# Altium schematic sheet Driver.SchDoc
size A3
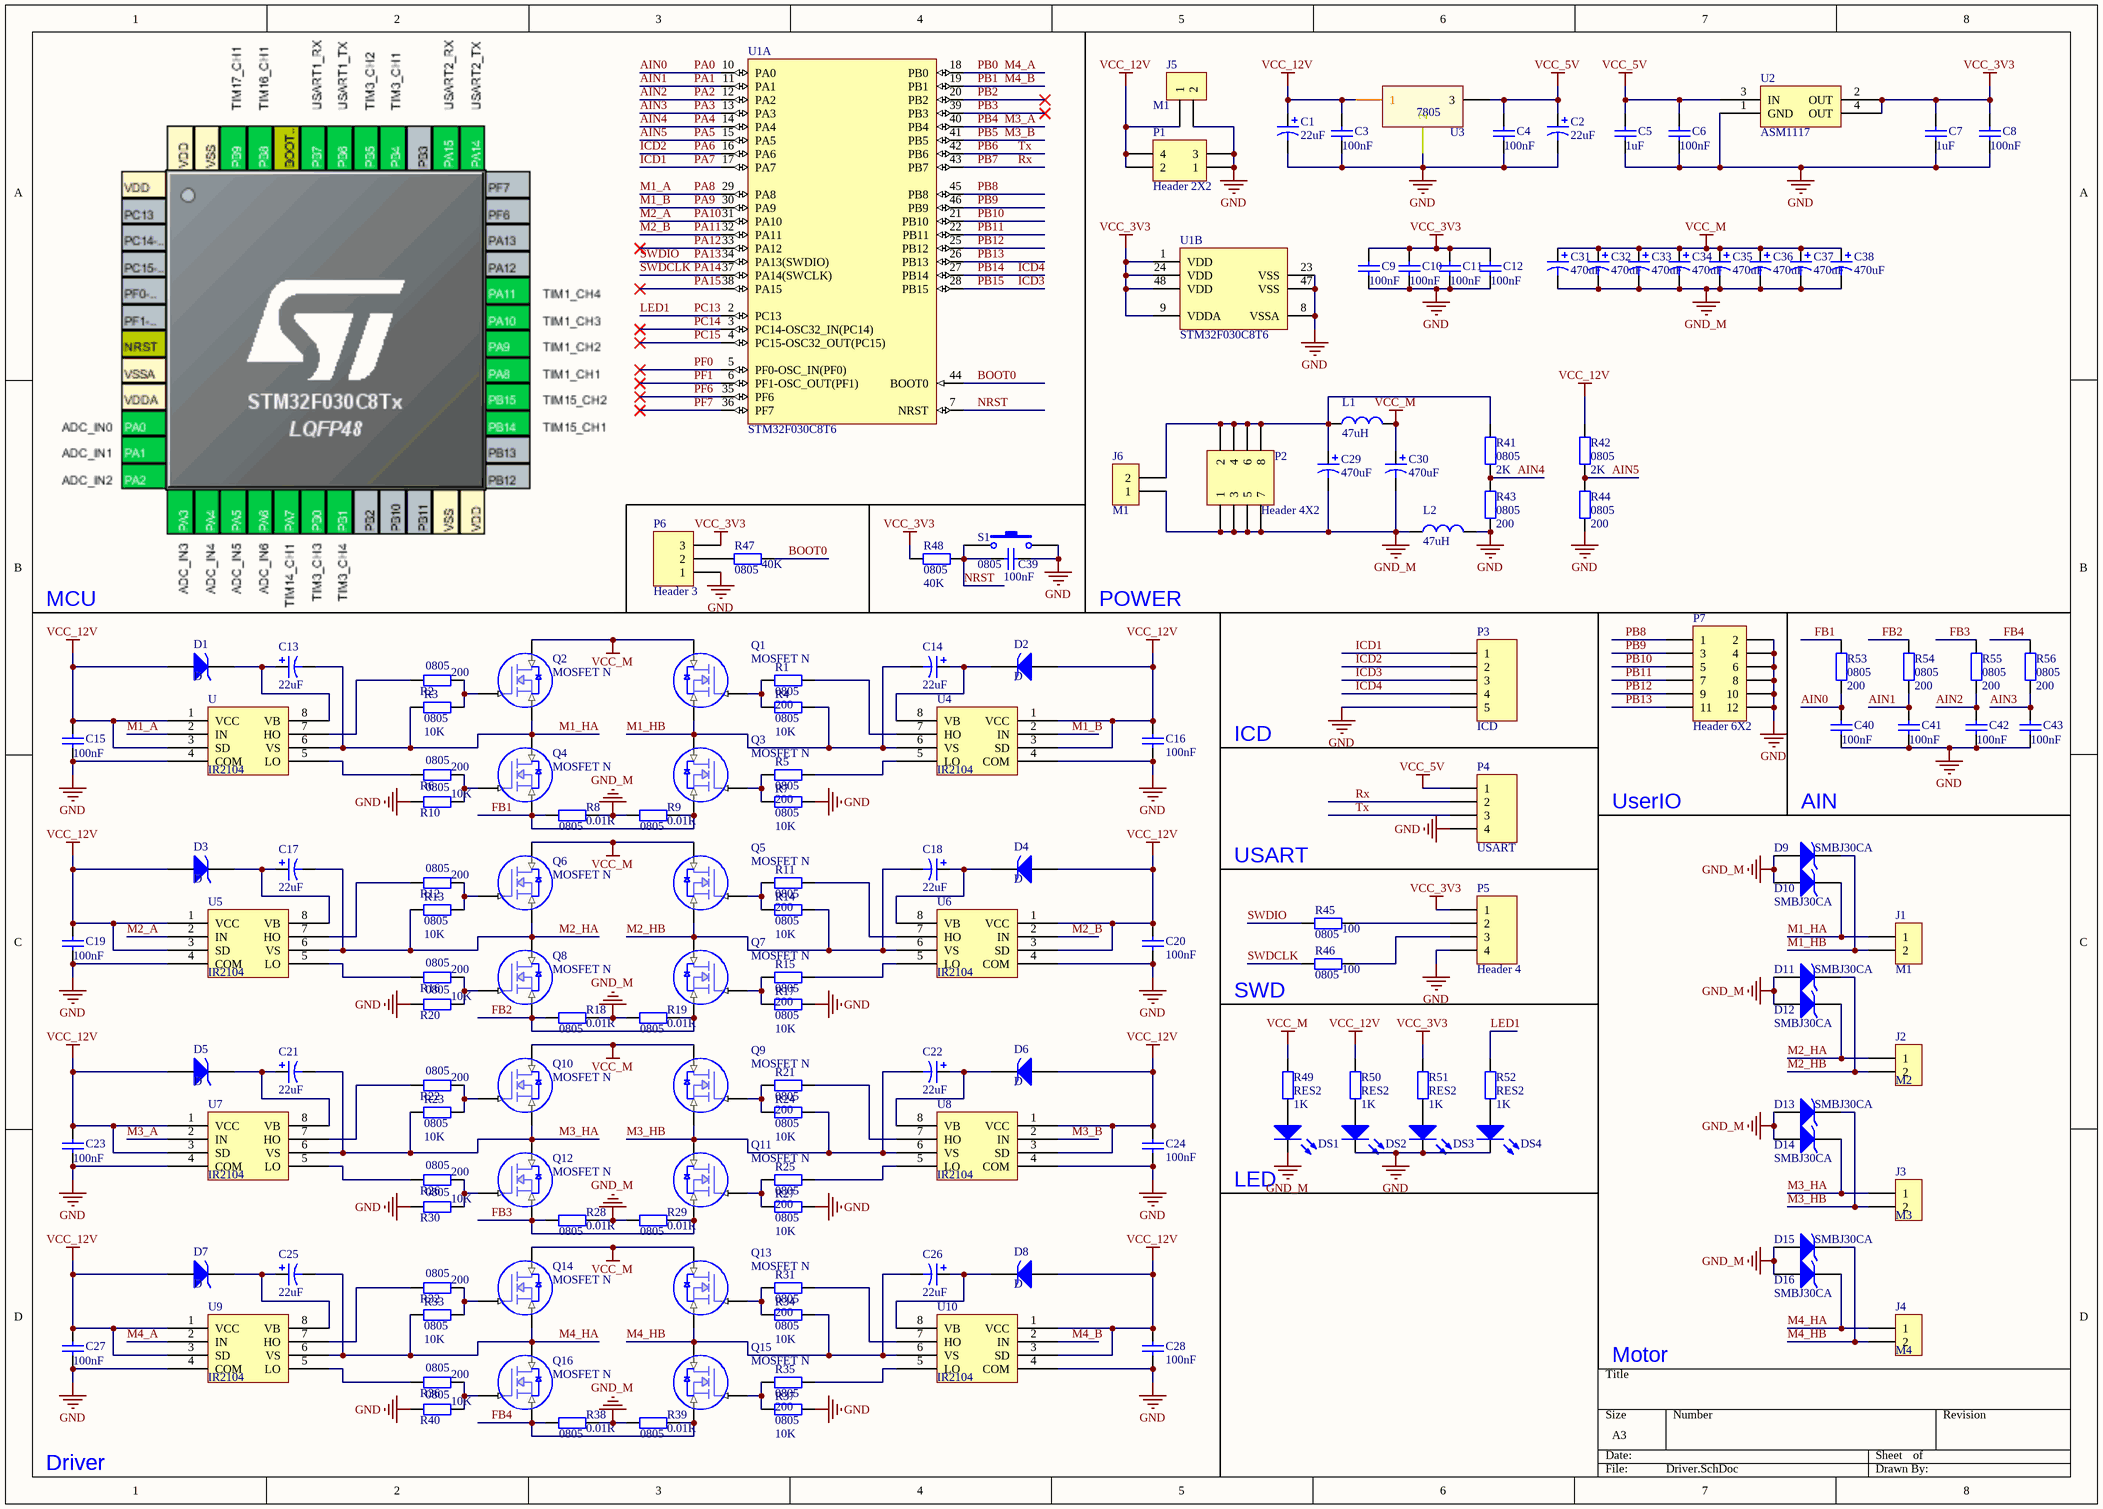
[diagram p0: Driver.SchDoc]

## Parts
C1  value 22uF  [CD C(6032)]  (hidden comment: CAP-ELEC)
C2  value 22uF  [CD C(6032)]  (hidden comment: CAP-ELEC)
C3  value 100nF  [C 0805_L]  (hidden comment: CAP)
C4  value 100nF  [C 0805_L]  (hidden comment: CAP)
C5  value 1uF  [C 0805_L]  (hidden comment: CAP)
C6  value 100nF  [C 0805_L]  (hidden comment: CAP)
C7  value 1uF  [C 0805_L]  (hidden comment: CAP)
C8  value 100nF  [C 0805_L]  (hidden comment: CAP)
C9  value 100nF  [C 0805_L]  (hidden comment: CAP)
C10  value 100nF  [C 0805_L]  (hidden comment: CAP)
C11  value 100nF  [C 0805_L]  (hidden comment: CAP)
C12  value 100nF  [C 0805_L]  (hidden comment: CAP)
C13  value 22uF  [CD C(6032)]  (hidden comment: CAP-ELEC)
C14  value 22uF  [CD C(6032)]  (hidden comment: CAP-ELEC)
C15  value 100nF  [C 0805_L]  (hidden comment: CAP)
C16  value 100nF  [C 0805_L]  (hidden comment: CAP)
C17  value 22uF  [CD C(6032)]  (hidden comment: CAP-ELEC)
C18  value 22uF  [CD C(6032)]  (hidden comment: CAP-ELEC)
C19  value 100nF  [C 0805_L]  (hidden comment: CAP)
C20  value 100nF  [C 0805_L]  (hidden comment: CAP)
C21  value 22uF  [CD C(6032)]  (hidden comment: CAP-ELEC)
C22  value 22uF  [CD C(6032)]  (hidden comment: CAP-ELEC)
C23  value 100nF  [C 0805_L]  (hidden comment: CAP)
C24  value 100nF  [C 0805_L]  (hidden comment: CAP)
C25  value 22uF  [CD C(6032)]  (hidden comment: CAP-ELEC)
C26  value 22uF  [CD C(6032)]  (hidden comment: CAP-ELEC)
C27  value 100nF  [C 0805_L]  (hidden comment: CAP)
C28  value 100nF  [C 0805_L]  (hidden comment: CAP)
C29  value 470uF  [CM E(8*10.2)]  (hidden comment: CAP-ELEC)
C30  value 470uF  [CM E(8*10.2)]  (hidden comment: CAP-ELEC)
C31  value 470uF  [CM E(8*10.2)]  (hidden comment: CAP-ELEC)
C32  value 470uF  [CM E(8*10.2)]  (hidden comment: CAP-ELEC)
C33  value 470uF  [CM E(8*10.2)]  (hidden comment: CAP-ELEC)
C34  value 470uF  [CM E(8*10.2)]  (hidden comment: CAP-ELEC)
C35  value 470uF  [CM E(8*10.2)]  (hidden comment: CAP-ELEC)
C36  value 470uF  [CM E(8*10.2)]  (hidden comment: CAP-ELEC)
C37  value 470uF  [CM E(8*10.2)]  (hidden comment: CAP-ELEC)
C38  value 470uF  [CM E(8*10.2)]  (hidden comment: CAP-ELEC)
C39  0805  value 100nF  [C 0805_M]
C40  value 100nF  [C 0805_L]  (hidden comment: CAP)
C41  value 100nF  [C 0805_L]  (hidden comment: CAP)
C42  value 100nF  [C 0805_L]  (hidden comment: CAP)
C43  value 100nF  [C 0805_L]  (hidden comment: CAP)
D1  D  [SOD-123]
D2  D  [SOD-123]
D3  D  [SOD-123]
D4  D  [SOD-123]
D5  D  [SOD-123]
D6  D  [SOD-123]
D7  D  [SOD-123]
D8  D  [SOD-123]
D9  SMBJ30CA  [SMB]
D10  SMBJ30CA  [SMB]
D11  SMBJ30CA  [SMB]
D12  SMBJ30CA  [SMB]
D13  SMBJ30CA  [SMB]
D14  SMBJ30CA  [SMB]
D15  SMBJ30CA  [SMB]
D16  SMBJ30CA  [SMB]
DS1  LED  [LED 0805B]  (value not drawn)
DS2  LED  [LED 0805B]  (value not drawn)
DS3  LED  [LED 0805B]  (value not drawn)
DS4  LED  [LED 0805B]  (value not drawn)
J1  M1  [DG1282-5.0]
J2  M2  [DG1282-5.0]
J3  M3  [DG1282-5.0]
J4  M4  [DG1282-5.0]
J5  M1  [DG1282-5.0]
J6  M1  [DG1282-5.0]
L1  value 47uH  [L-SMD-12]  (hidden comment: Inductor)
L2  value 47uH  [L-SMD-12]  (hidden comment: Inductor)
P1  Header 2X2  [HDR2.54-LI-2x2P]
P2  Header 4X2  [HDR2.54-LI-2x4P]
P3  ICD  [HDR2.54-LI-5P]
P4  USART  [HDR2.54-LI-4P]
P5  Header 4  [HDR2.54-LI-4P]
P6  Header 3  [HDR2.54-LI-3P]
P7  Header 6X2  [HDR2.54-LI-2x6P]
Q1  MOSFET N  [TO252]
Q2  MOSFET N  [TO252]
Q3  MOSFET N  [TO252]
Q4  MOSFET N  [TO252]
Q5  MOSFET N  [TO252]
Q6  MOSFET N  [TO252]
Q7  MOSFET N  [TO252]
Q8  MOSFET N  [TO252]
Q9  MOSFET N  [TO252]
Q10  MOSFET N  [TO252]
Q11  MOSFET N  [TO252]
Q12  MOSFET N  [TO252]
Q13  MOSFET N  [TO252]
Q14  MOSFET N  [TO252]
Q15  MOSFET N  [TO252]
Q16  MOSFET N  [TO252]
R1  0805  value 200  [R 0805_L]
R2  0805  value 200  [R 0805_L]
R3  0805  value 10K  [R 0805_L]
R4  0805  value 10K  [R 0805_L]
R5  0805  value 200  [R 0805_L]
R6  0805  value 200  [R 0805_L]
R7  0805  value 10K  [R 0805_L]
R8  0805  value 0.01R  [R 1206_L]
R9  0805  value 0.01R  [R 1206_L]
R10  0805  value 10K  [R 0805_L]
R11  0805  value 200  [R 0805_L]
R12  0805  value 200  [R 0805_L]
R13  0805  value 10K  [R 0805_L]
R14  0805  value 10K  [R 0805_L]
R15  0805  value 200  [R 0805_L]
R16  0805  value 200  [R 0805_L]
R17  0805  value 10K  [R 0805_L]
R18  0805  value 0.01R  [R 1206_L]
R19  0805  value 0.01R  [R 1206_L]
R20  0805  value 10K  [R 0805_L]
R21  0805  value 200  [R 0805_L]
R22  0805  value 200  [R 0805_L]
R23  0805  value 10K  [R 0805_L]
R24  0805  value 10K  [R 0805_L]
R25  0805  value 200  [R 0805_L]
R26  0805  value 200  [R 0805_L]
R27  0805  value 10K  [R 0805_L]
R28  0805  value 0.01R  [R 1206_L]
R29  0805  value 0.01R  [R 1206_L]
R30  0805  value 10K  [R 0805_L]
R31  0805  value 200  [R 0805_L]
R32  0805  value 200  [R 0805_L]
R33  0805  value 10K  [R 0805_L]
R34  0805  value 10K  [R 0805_L]
R35  0805  value 200  [R 0805_L]
R36  0805  value 200  [R 0805_L]
R37  0805  value 10K  [R 0805_L]
R38  0805  value 0.01R  [R 1206_L]
R39  0805  value 0.01R  [R 1206_L]
R40  0805  value 10K  [R 0805_L]
R41  0805  value 2K  [R 0805_L]
R42  0805  value 2K  [R 0805_L]
R43  0805  value 200  [R 0805_L]
R44  0805  value 200  [R 0805_L]
R45  0805  value 100  [R 0805_L]
R46  0805  value 100  [R 0805_L]
R47  0805  value 40K  [R 0805_L]
R48  0805  value 40K  [R 0805_L]
R49  RES2  value 1K  [R 0805_L]
R50  RES2  value 1K  [R 0805_L]
R51  RES2  value 1K  [R 0805_L]
R52  RES2  value 1K  [R 0805_L]
R53  0805  value 200  [R 0805_L]
R54  0805  value 200  [R 0805_L]
R55  0805  value 200  [R 0805_L]
R56  0805  value 200  [R 0805_L]
S1  SW  [TSW DIP-3*6*4.3]  (value not drawn)
U  IR2104  [SOP8_M]
U1  STM32F030C8T6  [STM-LQFP48_N]  (parts A,B of 2)
U2  ASM1117  [SOT-223]
U3  7805  [TO220B]
U4  IR2104  [SOP8_M]
U5  IR2104  [SOP8_M]
U6  IR2104  [SOP8_M]
U7  IR2104  [SOP8_M]
U8  IR2104  [SOP8_M]
U9  IR2104  [SOP8_M]
U10  IR2104  [SOP8_M]

## Nets
GND: C1.2 C2.2 C3.2 C4.2 C5.2 C6.2 C7.2 C8.2 C9.2 C10.2 C11.2 C12.2 C15.2 C16.2 C19.2 C20.2 C23.2 C24.2 C27.2 C28.2 C39.1 C40.2 C41.2 C42.2 C43.2 DS2.2(K) DS3.2(K) DS4.2(K) J5.2 L2.2 P1.1 P1.3 P3.5 P4.4 P5.4 P6.1 P7.2 P7.4 P7.6 P7.8 P7.10 P7.12 R7.1 R10.1 R17.1 R20.1 R27.1 R30.1 R37.1 R40.1 R43.2 R44.2 S1.2 U.4(COM) U1.8(VSSA) U1.23(VSS) U1.47(VSS) U2.1(GND) U3.2 U4.4(COM) U5.4(COM) U6.4(COM) U7.4(COM) U8.4(COM) U9.4(COM) U10.4(COM)
GND_M: C29.2 C30.2 C31.2 C32.2 C33.2 C34.2 C35.2 C36.2 C37.2 C38.2 D9.1(A) D10.1(A) D11.1(A) D12.1(A) D13.1(A) D14.1(A) D15.1(A) D16.1(A) DS1.2(K) J6.1 L2.1 P2.1 P2.3 P2.5 P2.7 R8.2 R9.1 R18.2 R19.1 R28.2 R29.1 R38.2 R39.1
VCC_3V3: C7.1 C8.1 C9.1 C10.1 C11.1 C12.1 P5.1 P6.3 R48.1 R51.2 U1.1(VDD) U1.9(VDDA) U1.24(VDD) U1.48(VDD) U2.2(OUT) U2.4(OUT)
VCC_5V: C2.1 C4.1 C5.1 C6.1 P4.1 U2.3(IN) U3.3
VCC_12V: C1.1 C3.1 C15.1 C16.1 C19.1 C20.1 C23.1 C24.1 C27.1 C28.1 D1.1(A) D2.1(A) D3.1(A) D4.1(A) D5.1(A) D6.1(A) D7.1(A) D8.1(A) J5.1 P1.2 P1.4 R42.1 R50.2 U.1(VCC) U.3(SD) U3.1 U4.1(VCC) U4.3(SD) U5.1(VCC) U5.3(SD) U6.1(VCC) U6.3(SD) U7.1(VCC) U7.3(SD) U8.1(VCC) U8.3(SD) U9.1(VCC) U9.3(SD) U10.1(VCC) U10.3(SD)
VCC_M: C30.1 C31.1 C32.1 C33.1 C34.1 C35.1 C36.1 C37.1 C38.1 L1.2 Q1.2(D) Q2.2(D) Q5.2(D) Q6.2(D) Q9.2(D) Q10.2(D) Q13.2(D) Q14.2(D) R49.2
AIN0: C40.1 R53.1 U1.10(PA0)  [also labelled PA0]
AIN1: C41.1 R54.1 U1.11(PA1)  [also labelled PA1]
AIN2: C42.1 R55.1 U1.12(PA2)  [also labelled PA2]
AIN3: C43.1 R56.1 U1.13(PA3)  [also labelled PA3]
AIN4: R41.2 R43.1 U1.14(PA4)  [also labelled PA4]
AIN5: R42.2 R44.1 U1.15(PA5)  [also labelled PA5]
BOOT0: R47.2 U1.44(BOOT0)
FB1: Q3.3(S) Q4.3(S) R8.1 R9.2 R53.2
FB2: Q7.3(S) Q8.3(S) R18.1 R19.2 R54.2
FB3: Q11.3(S) Q12.3(S) R28.1 R29.2 R55.2
FB4: Q15.3(S) Q16.3(S) R38.1 R39.2 R56.2
ICD1: P3.1 U1.17(PA7)  [also labelled PA7]
ICD2: P3.2 U1.16(PA6)  [also labelled PA6]
ICD3: P3.3 U1.28(PB15)  [also labelled PB15]
ICD4: P3.4 U1.27(PB14)  [also labelled PB14]
LED1: R52.2 U1.2(PC13)  [also labelled PC13]
M1_A: U.2(IN) U1.29(PA8)  [also labelled PA8]
M1_B: U1.30(PA9) U4.2(IN)  [also labelled PA9]
M1_HA: C13.2 D10.2(K) J1.1 Q2.3(S) Q4.2(D) R3.2 U.6(VS)
M1_HB: C14.2 D9.2(K) J1.2 Q1.3(S) Q3.2(D) R4.2 U4.6(VS)
M2_A: U1.31(PA10) U5.2(IN)  [also labelled PA10]
M2_B: U1.32(PA11) U6.2(IN)  [also labelled PA11]
M2_HA: C17.2 D12.2(K) J2.1 Q6.3(S) Q8.2(D) R13.2 U5.6(VS)
M2_HB: C18.2 D11.2(K) J2.2 Q5.3(S) Q7.2(D) R14.2 U6.6(VS)
M3_A: U1.40(PB4) U7.2(IN)  [also labelled PB4]
M3_B: U1.41(PB5) U8.2(IN)  [also labelled PB5]
M3_HA: C21.2 D14.2(K) J3.1 Q10.3(S) Q12.2(D) R23.2 U7.6(VS)
M3_HB: C22.2 D13.2(K) J3.2 Q9.3(S) Q11.2(D) R24.2 U8.6(VS)
M4_A: U1.18(PB0) U9.2(IN)  [also labelled PB0]
M4_B: U1.19(PB1) U10.2(IN)  [also labelled PB1]
M4_HA: C25.2 D16.2(K) J4.1 Q14.3(S) Q16.2(D) R33.2 U9.6(VS)
M4_HB: C26.2 D15.2(K) J4.2 Q13.3(S) Q15.2(D) R34.2 U10.6(VS)
NRST: C39.2 R48.2 S1.1 U1.7(NRST)
PA12: U1.33(PA12)
PA13: R45.1 U1.34(PA13(SWDIO))  [also labelled SWDIO]
PA14: R46.1 U1.37(PA14(SWCLK))  [also labelled SWDCLK]
PA15: U1.38(PA15)
PB2: U1.20(PB2)
PB3: U1.39(PB3)
PB6: P4.3 U1.42(PB6)  [also labelled Tx]
PB7: P4.2 U1.43(PB7)  [also labelled Rx]
PB8: P7.1 U1.45(PB8)
PB9: P7.3 U1.46(PB9)
PB10: P7.5 U1.21(PB10)
PB11: P7.7 U1.22(PB11)
PB12: P7.9 U1.25(PB12)
PB13: P7.11 U1.26(PB13)
PC14: U1.3(PC14-OSC32_IN(PC14))
PC15: U1.4(PC15-OSC32_OUT(PC15))
PF0: U1.5(PF0-OSC_IN(PF0))
PF1: U1.6(PF1-OSC_OUT(PF1))
PF6: U1.35(PF6)
PF7: U1.36(PF7)
NetC13_1: C13.1 D1.2(K) U.8(VB)
NetC14_1: C14.1 D2.2(K) U4.8(VB)
NetC17_1: C17.1 D3.2(K) U5.8(VB)
NetC18_1: C18.1 D4.2(K) U6.8(VB)
NetC21_1: C21.1 D5.2(K) U7.8(VB)
NetC22_1: C22.1 D6.2(K) U8.8(VB)
NetC25_1: C25.1 D7.2(K) U9.8(VB)
NetC26_1: C26.1 D8.2(K) U10.8(VB)
NetC29_1: C29.1 J6.2 L1.1 P2.2 P2.4 P2.6 P2.8 R41.1
NetDS1_1: DS1.1(A) R49.1
NetDS2_1: DS2.1(A) R50.1
NetDS3_1: DS3.1(A) R51.1
NetDS4_1: DS4.1(A) R52.1
NetP5_2: P5.2 R45.2
NetP5_3: P5.3 R46.2
NetP6_2: P6.2 R47.1
NetQ1_1: Q1.1(G) R1.2 R4.1
NetQ2_1: Q2.1(G) R2.2 R3.1
NetQ3_1: Q3.1(G) R5.2 R7.2
NetQ4_1: Q4.1(G) R6.2 R10.2
NetQ5_1: Q5.1(G) R11.2 R14.1
NetQ6_1: Q6.1(G) R12.2 R13.1
NetQ7_1: Q7.1(G) R15.2 R17.2
NetQ8_1: Q8.1(G) R16.2 R20.2
NetQ9_1: Q9.1(G) R21.2 R24.1
NetQ10_1: Q10.1(G) R22.2 R23.1
NetQ11_1: Q11.1(G) R25.2 R27.2
NetQ12_1: Q12.1(G) R26.2 R30.2
NetQ13_1: Q13.1(G) R31.2 R34.1
NetQ14_1: Q14.1(G) R32.2 R33.1
NetQ15_1: Q15.1(G) R35.2 R37.2
NetQ16_1: Q16.1(G) R36.2 R40.2
NetR1_1: R1.1 U4.7(HO)
NetR2_1: R2.1 U.7(HO)
NetR5_1: R5.1 U4.5(LO)
NetR6_1: R6.1 U.5(LO)
NetR11_1: R11.1 U6.7(HO)
NetR12_1: R12.1 U5.7(HO)
NetR15_1: R15.1 U6.5(LO)
NetR16_1: R16.1 U5.5(LO)
NetR21_1: R21.1 U8.7(HO)
NetR22_1: R22.1 U7.7(HO)
NetR25_1: R25.1 U8.5(LO)
NetR26_1: R26.1 U7.5(LO)
NetR31_1: R31.1 U10.7(HO)
NetR32_1: R32.1 U9.7(HO)
NetR35_1: R35.1 U10.5(LO)
NetR36_1: R36.1 U9.5(LO)

## Notes on the sheet
- MCU
- POWER
- ICD
- UserIO
- AIN
- USART
- SWD
- (near DS1) LED
- Motor
- Driver
- Title
- Size:
- Date:
- A3
- Number:
- Time:
- Revision:
- Sheet
- of
- File:

## Library data of the parts
C39 = CAP
D1-D16 = D: High Conductance Fast Diode; Published: 8-Jun-2000; LatestRevisionDate: 17-Jul-2002; LatestRevisionNote: Re-released for DXP Platform.; DatasheetVersion: 1997; PackageReference: DO-35; Publisher: Altium Limited; PackageDescription: Diode, Axial; Body 3.8 x 1.9 mm (LxDia. max), Lead Dia. 0.53 mm (max); Code_JEDEC: DO-204-AH; ComponentLink1Description: Manufacturer Link; ComponentLink1URL: http://www.fairchildsemi.com/; ComponentLink2Description: Datasheet; ComponentLink2URL: http://www.fairchildsemi.com/ds/1N%2F1N4148.pdf
J1-J6 = CON2
L1 L2 = Inductor: 电感; Code_IEC: 1005; Published: 8-Jun-2000; LatestRevisionDate: 17-Jul-2002; LatestRevisionNote: Re-released for DXP Platform.; PackageReference: 0402-A; Publisher: Altium Limited; Code_JEITA: 0402
P1 = Header 2X2: Header, 2-Pin, Dual row; LatestRevisionDate: 17-Jul-2002; LatestRevisionNote: Re-released for DXP Platform.; Publisher: Altium Limited
P2 = Header 4X2: Header, 4-Pin, Dual row; LatestRevisionDate: 17-Jul-2002; LatestRevisionNote: Re-released for DXP Platform.; Publisher: Altium Limited
P3 = Header 5: Header, 5-Pin; LatestRevisionDate: 17-Jul-2002; LatestRevisionNote: Re-released for DXP Platform.; Publisher: Altium Limited
P4 P5 = Header 4: Header, 4-Pin; LatestRevisionDate: 17-Jul-2002; LatestRevisionNote: Re-released for DXP Platform.; Publisher: Altium Limited
P6 = Header 3: Header, 3-Pin; LatestRevisionDate: 17-Jul-2002; LatestRevisionNote: Re-released for DXP Platform.; Publisher: Altium Limited
P7 = Header 6X2: Header, 6-Pin, Dual row; LatestRevisionDate: 17-Jul-2002; LatestRevisionNote: Re-released for DXP Platform.; Publisher: Altium Limited
R1-R56 = RES2: Resistor; Published: 8-Jun-2000; LatestRevisionDate: 17-Jul-2002; LatestRevisionNote: Re-released for DXP Platform.; PackageReference: AXIAL-0.3; Publisher: Altium Limited; PackageDescription: Axial Device, Thru-Hole; 2 Leads; 0.3 in Pin Spacing
U1 = STM32F030C8T6: ARM Cortex-M0 32-bit MCU, 64 KB Flash, 8 KB Internal RAM, 39 I/Os, 48-pin LQFP, -40 to 85 degC, Tray; FLASH Size (Prog) (kB): 64; I/Os (High Current): 39; Internal RAM Size (kB): 8; Operating Frequency(F) (Processor speed) (MHz): 48; Supply Voltage(Vcc) min (V): 2.4; DatasheetVersion: Rev. 1; PackageVersion: Rev. 6, 06/2013; PackageReference: LQFP48; PackageDescription: 48-Pin Low Profile Quad Flat Package, 7 x 7 mm Body, 0.5 mm Pitch; Supplier 1: Digi-Key; Supplier Part Number 1: 497-14043-ND; Supplier 2: Newark; Supplier Part Number 2: 06X3647; Supplier 3: Mouser; Supplier Part Number 3: 511-STM32F030C8T6; Core: ARM Cortex-M0; Packing: Tray; Mounting Technology: Surface Mount; PartNumber: STM32F030C8T6; ComponentLink1Description: Manufacturer URL; ComponentLink1URL: http://www.st.com/web/en/home.html; ComponentLink2Description: Datasheet; ComponentLink2URL: http://www.st.com/st-web-ui/static/active/en/resource/technical/document/datasheet/DM00088500.pdf; ComponentLink3Description: Package Specification; ComponentLink3URL: http://www.st.com/st-web-ui/static/active/en/resource/technical/document/datasheet/DM00058181.pdf
U2 = ASM1117: 3.3V稳压芯片
S1 = SW: Published: 24-Mar-1999; LatestRevisionDate: 17-Jul-2002; LatestRevisionNote: Re-released for DXP Platform.; Publisher: Altium Limited